# EAGLE schematic Machine Shop TinkerAccess (EAGLE 9.6.2)

## Sheet 1 of 3
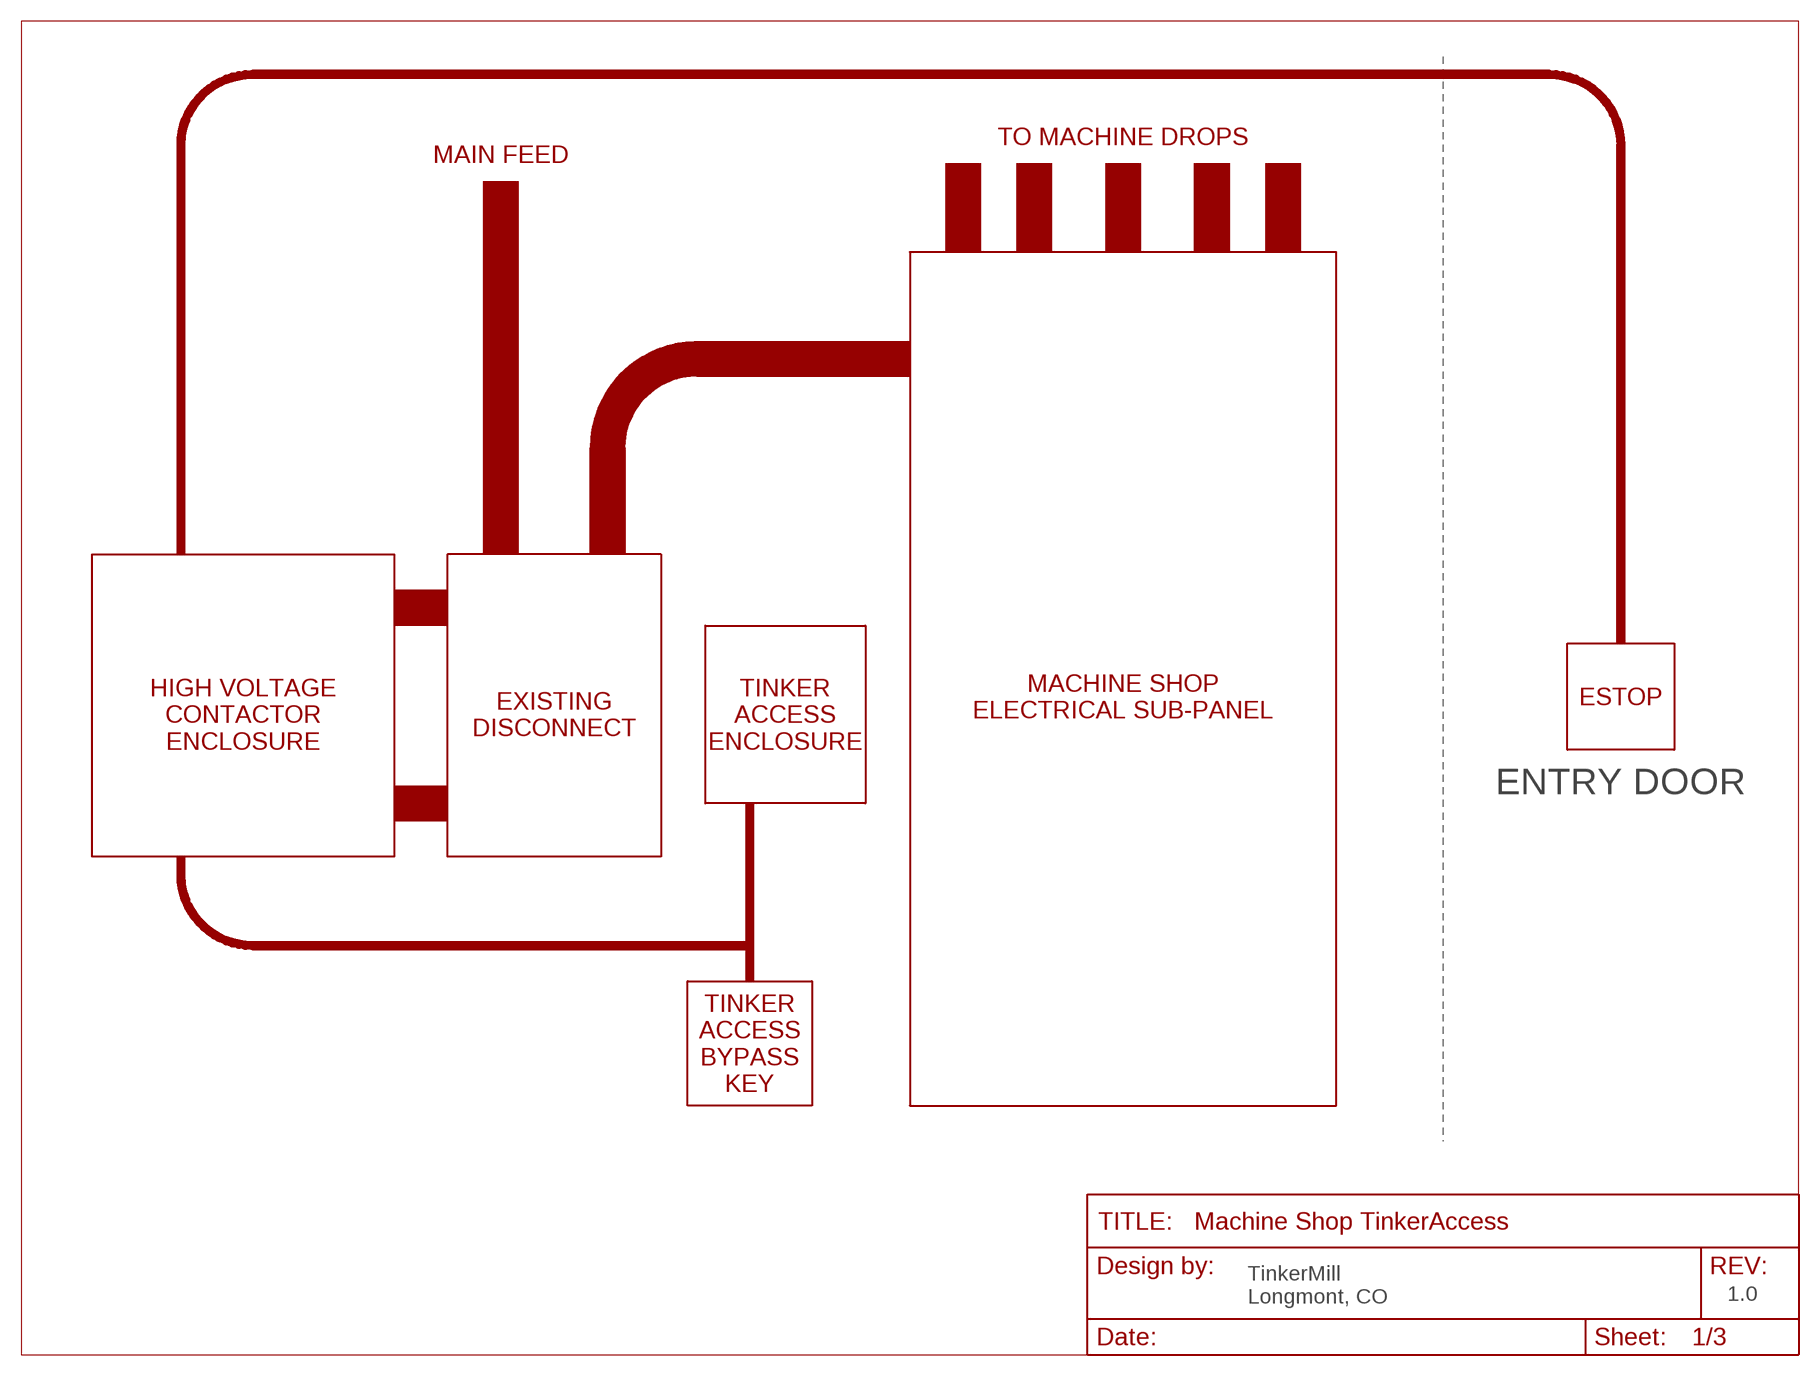
[diagram p0: schematic, sheet 1]

### Notes on the sheet
- TO MACHINE DROPS
- MAIN FEED
- MACHINE SHOP
  ELECTRICAL SUB-PANEL
- ESTOP
- HIGH VOLTAGE
  CONTACTOR
  ENCLOSURE
- EXISTING
  DISCONNECT
- TINKER
  ACCESS
  ENCLOSURE
- ENTRY DOOR
- TINKER
  ACCESS
  BYPASS
  KEY
- TinkerMill
  Longmont, CO
- 1.0

## Sheet 2 of 3
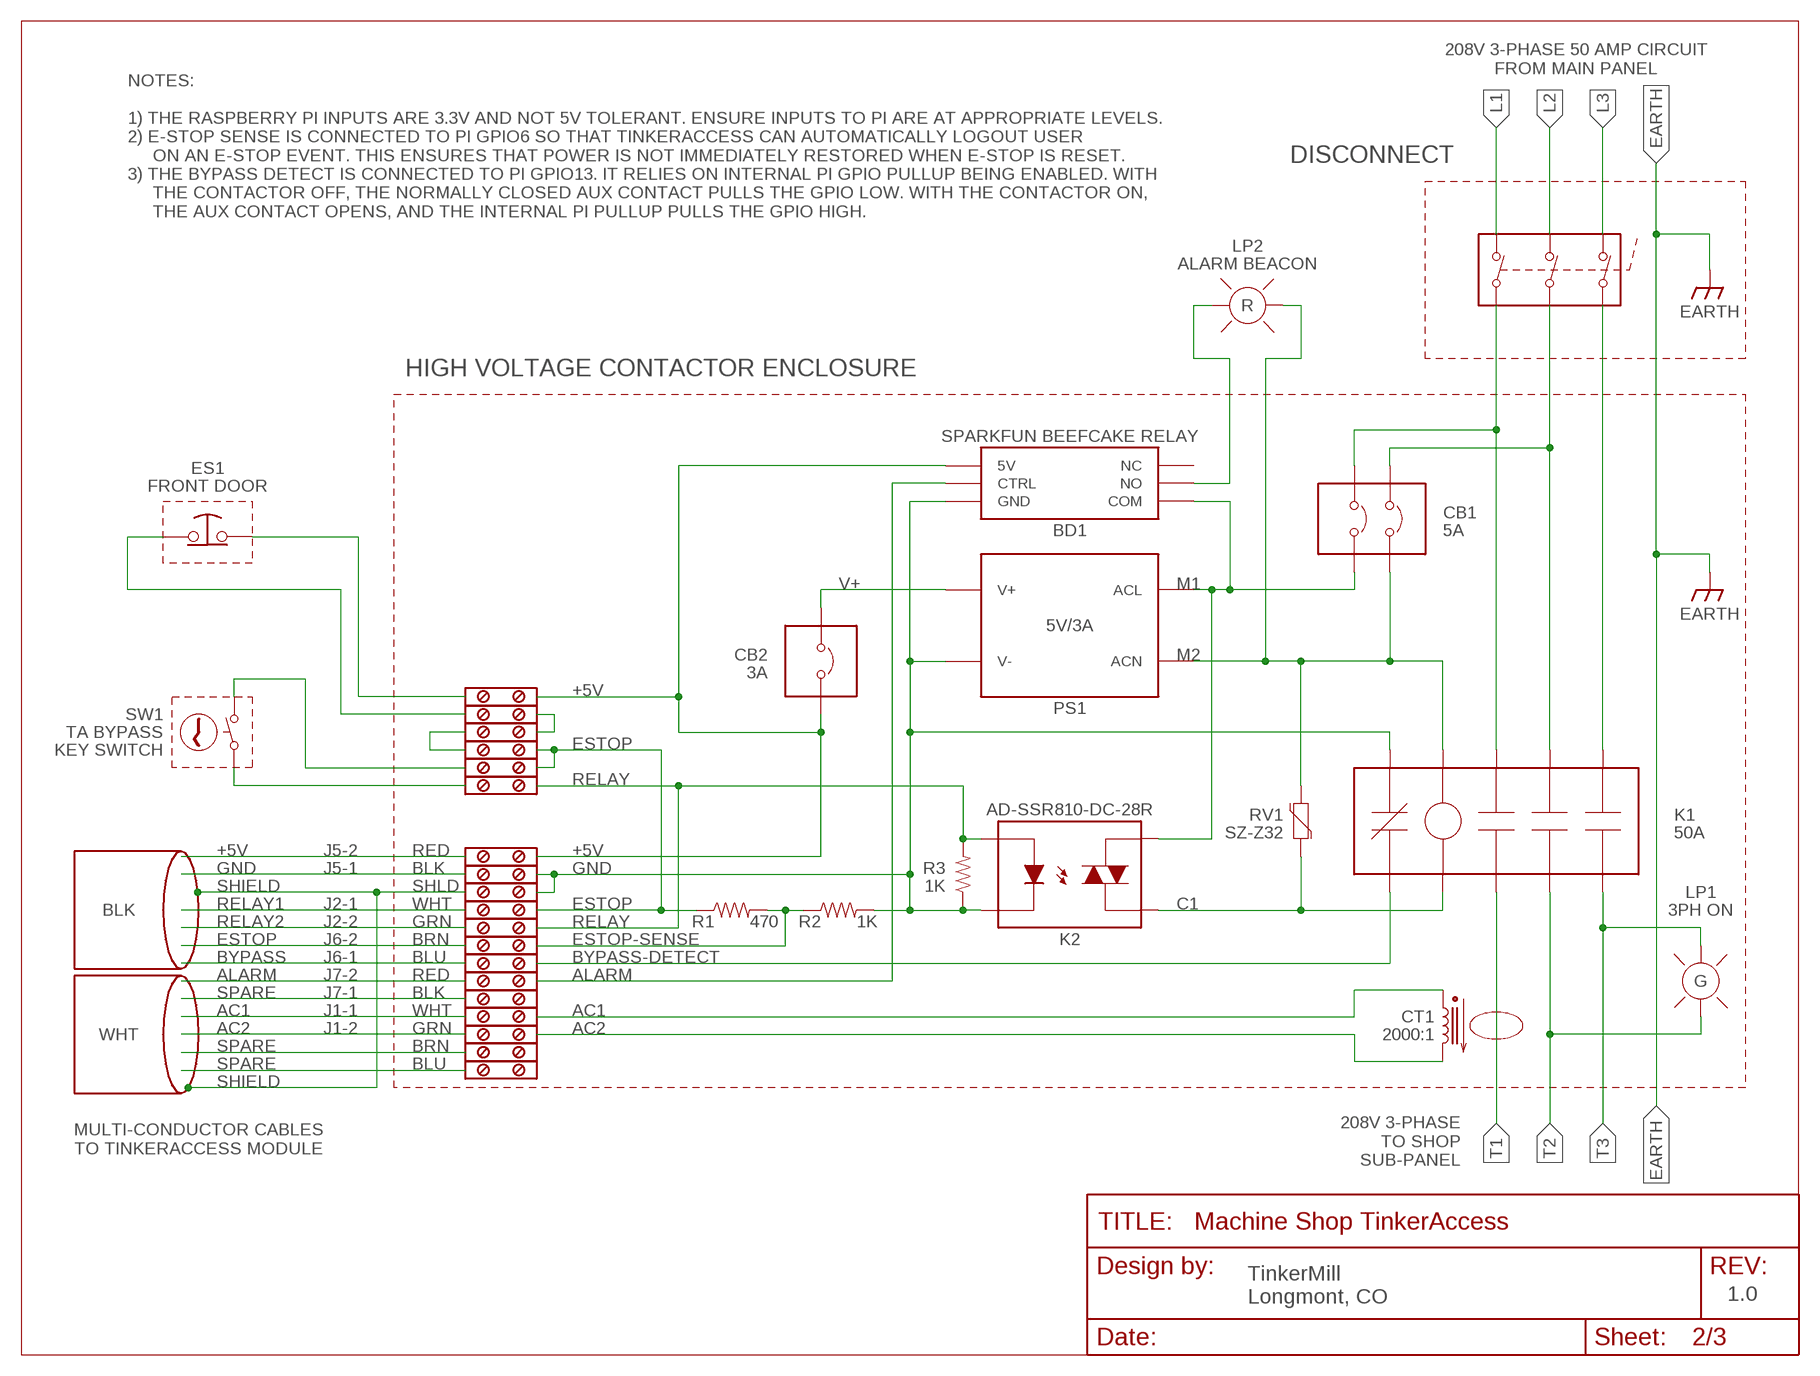
[diagram p1: schematic, sheet 2]

### Parts
BD1  SPARKFUN BEEFCAKE RELAY  SPARKFUN_BEEFCAKE  (no package)
CB1  5A  CIRCUIT_BREAKER_2POLE  (no package)
CB2  3A  CIRCUIT_BREAKER_1POLE  (no package)
CT1  2000:1  CURRENT_TRANSFORMER_TALEMA_AC1020  [TALEMA_AC1020]
ES1  FRONT DOOR  ESTOP_SWITCH  (no package)
K1  50A  CONTACTOR_3POLE_NC_AUX  (no package)
K2  AD-SSR810-DC-28R  SOLID_STATE_RELAY  (no package)
LP1  3PH ON  INDICATOR_LAMP  (no package)
LP2  ALARM BEACON  INDICATOR_LAMP  (no package)
PS1  5V/3A  POWER_SUPPLY  (no package)
R1  470  RESISTOR_PTH_1/4W  [AXIAL_0.4]
R2  1K  RESISTOR_PTH_1/4W  [AXIAL_0.4]
R3  1K  RESISTOR_PTH_1/4W  [AXIAL_0.4]
RV1  SZ-Z32  VARISTOR_EPCOS_SK14K320  [EPCOS_14MM_DISC_5.4MM_TH]
SW1  TA BYPASS  KEYED_SWITCH  (no package)
SW2  DISCONNECT_3POLE  (no package)
TB1  TERMINAL_BLOCK  (no package)
TB2  TERMINAL_BLOCK  (no package)
TB3  TERMINAL_BLOCK  (no package)
TB4  TERMINAL_BLOCK  (no package)
TB5  TERMINAL_BLOCK  (no package)
TB6  TERMINAL_BLOCK  (no package)
TB7  TERMINAL_BLOCK  (no package)
TB8  TERMINAL_BLOCK  (no package)
TB9  TERMINAL_BLOCK  (no package)
TB10  TERMINAL_BLOCK  (no package)
TB11  TERMINAL_BLOCK  (no package)
TB12  TERMINAL_BLOCK  (no package)
TB13  TERMINAL_BLOCK  (no package)
TB14  TERMINAL_BLOCK  (no package)
TB15  TERMINAL_BLOCK  (no package)
TB17  TERMINAL_BLOCK  (no package)
TB18  TERMINAL_BLOCK  (no package)
TB19  TERMINAL_BLOCK  (no package)
TB20  TERMINAL_BLOCK  (no package)

### Nets
+5V: BD1.5V CB2.T1 TB1.B TB13.B
AC1: CT1.1 TB10.B
AC2: CT1.2 TB4.B
ALARM: BD1.CTRL TB8.B
BLK1: TB2.A ; also sheet 3
BLK2: TB11.A ; also sheet 3
BLU1: TB9.A ; also sheet 3
BLU2: TB15.A ; also sheet 3
BRN1: TB7.A ; also sheet 3
BRN2: TB12.A ; also sheet 3
BYPASS-DETECT: K1.NC2 TB9.B
C1: K1.A2 K2.L2 RV1.1
ESTOP: R1.1 TB5.B TB18.B TB19.B
ESTOP-SENSE: R1.2 R2.1 TB7.B
GND: BD1.GND K1.NC1 K2.A2 PS1.V- R2.2 R3.1 TB2.B TB3.B
GRN1: TB6.A ; also sheet 3
GRN2: TB4.A ; also sheet 3
L1: SW2.L1
L2: SW2.L2
L3: SW2.L3
M1: BD1.COM CB1.T1 K2.L1 PS1.ACL
M2: CB1.T2 K1.A1 LP2.2 PS1.ACN RV1.2
N$1: TB17.A TB18.A
N$2: BD1.NO LP2.1
N$5: SW1.1 TB19.A
N$7: SW1.2 TB20.A
N$8: TB14.B TB17.B
N$15: ES1.1 TB14.A
N$16: ES1.2 TB13.A
RED1: TB1.A ; also sheet 3
RED2: TB8.A ; also sheet 3
RELAY: K2.A1 R3.2 TB6.B TB20.B
S1: CB1.L1 K1.L1 SW2.T1
S2: CB1.L2 K1.L2 SW2.T2
S3: K1.L3 SW2.T3
SHLD: TB3.A
T1: K1.T1
T2: K1.T2 LP1.1
T3: K1.T3 LP1.2
V+: CB2.L1 PS1.V+
WHT1: TB5.A ; also sheet 3
WHT2: TB10.A ; also sheet 3
Unconnected: BD1.NC TB11.B TB12.B TB15.B

### Notes on the sheet
- NOTES:
  
  1) THE RASPBERRY PI INPUTS ARE 3.3V AND NOT 5V TOLERANT. ENSURE INPUTS TO PI ARE AT APPROPRIATE LEVELS.
  2) E-STOP SENSE IS CONNECTED TO PI GPIO6 SO THAT TINKERACCESS CAN AUTOMATICALLY LOGOUT USER
       ON AN E-STOP EVENT. THIS ENSURES THAT POWER IS NOT IMMEDIATELY RESTORED WHEN E-STOP IS RESET.
  3) THE BYPASS DETECT IS CONNECTED TO PI GPIO13. IT RELIES ON INTERNAL PI GPIO PULLUP BEING ENABLED. WITH
       THE CONTACTOR OFF, THE NORMALLY CLOSED AUX CONTACT PULLS THE GPIO LOW. WITH THE CONTACTOR ON,
       THE AUX CONTACT OPENS, AND THE INTERNAL PI PULLUP PULLS THE GPIO HIGH.
- 208V 3-PHASE 50 AMP CIRCUIT
  FROM MAIN PANEL
- DISCONNECT
- R
- HIGH VOLTAGE CONTACTOR ENCLOSURE
- KEY SWITCH
- +5V | J5-2 | RED
- GND | J5-1 | BLK
- SHIELD | SHLD
- BLK | RELAY1 | J2-1 | WHT
- RELAY2 | J2-2 | GRN
- ESTOP | J6-2 | BRN
- BYPASS | J6-1 | BLU
- ALARM | J7-2 | RED | G
- SPARE | J7-1 | BLK
- AC1 | J1-1 | WHT
- WHT | AC2 | J1-2 | GRN
- SPARE | BRN
- SPARE | BLU
- SHIELD
- MULTI-CONDUCTOR CABLES
  TO TINKERACCESS MODULE
- 208V 3-PHASE
  TO SHOP
  SUB-PANEL
- TinkerMill
  Longmont, CO
- 1.0

## Sheet 3 of 3
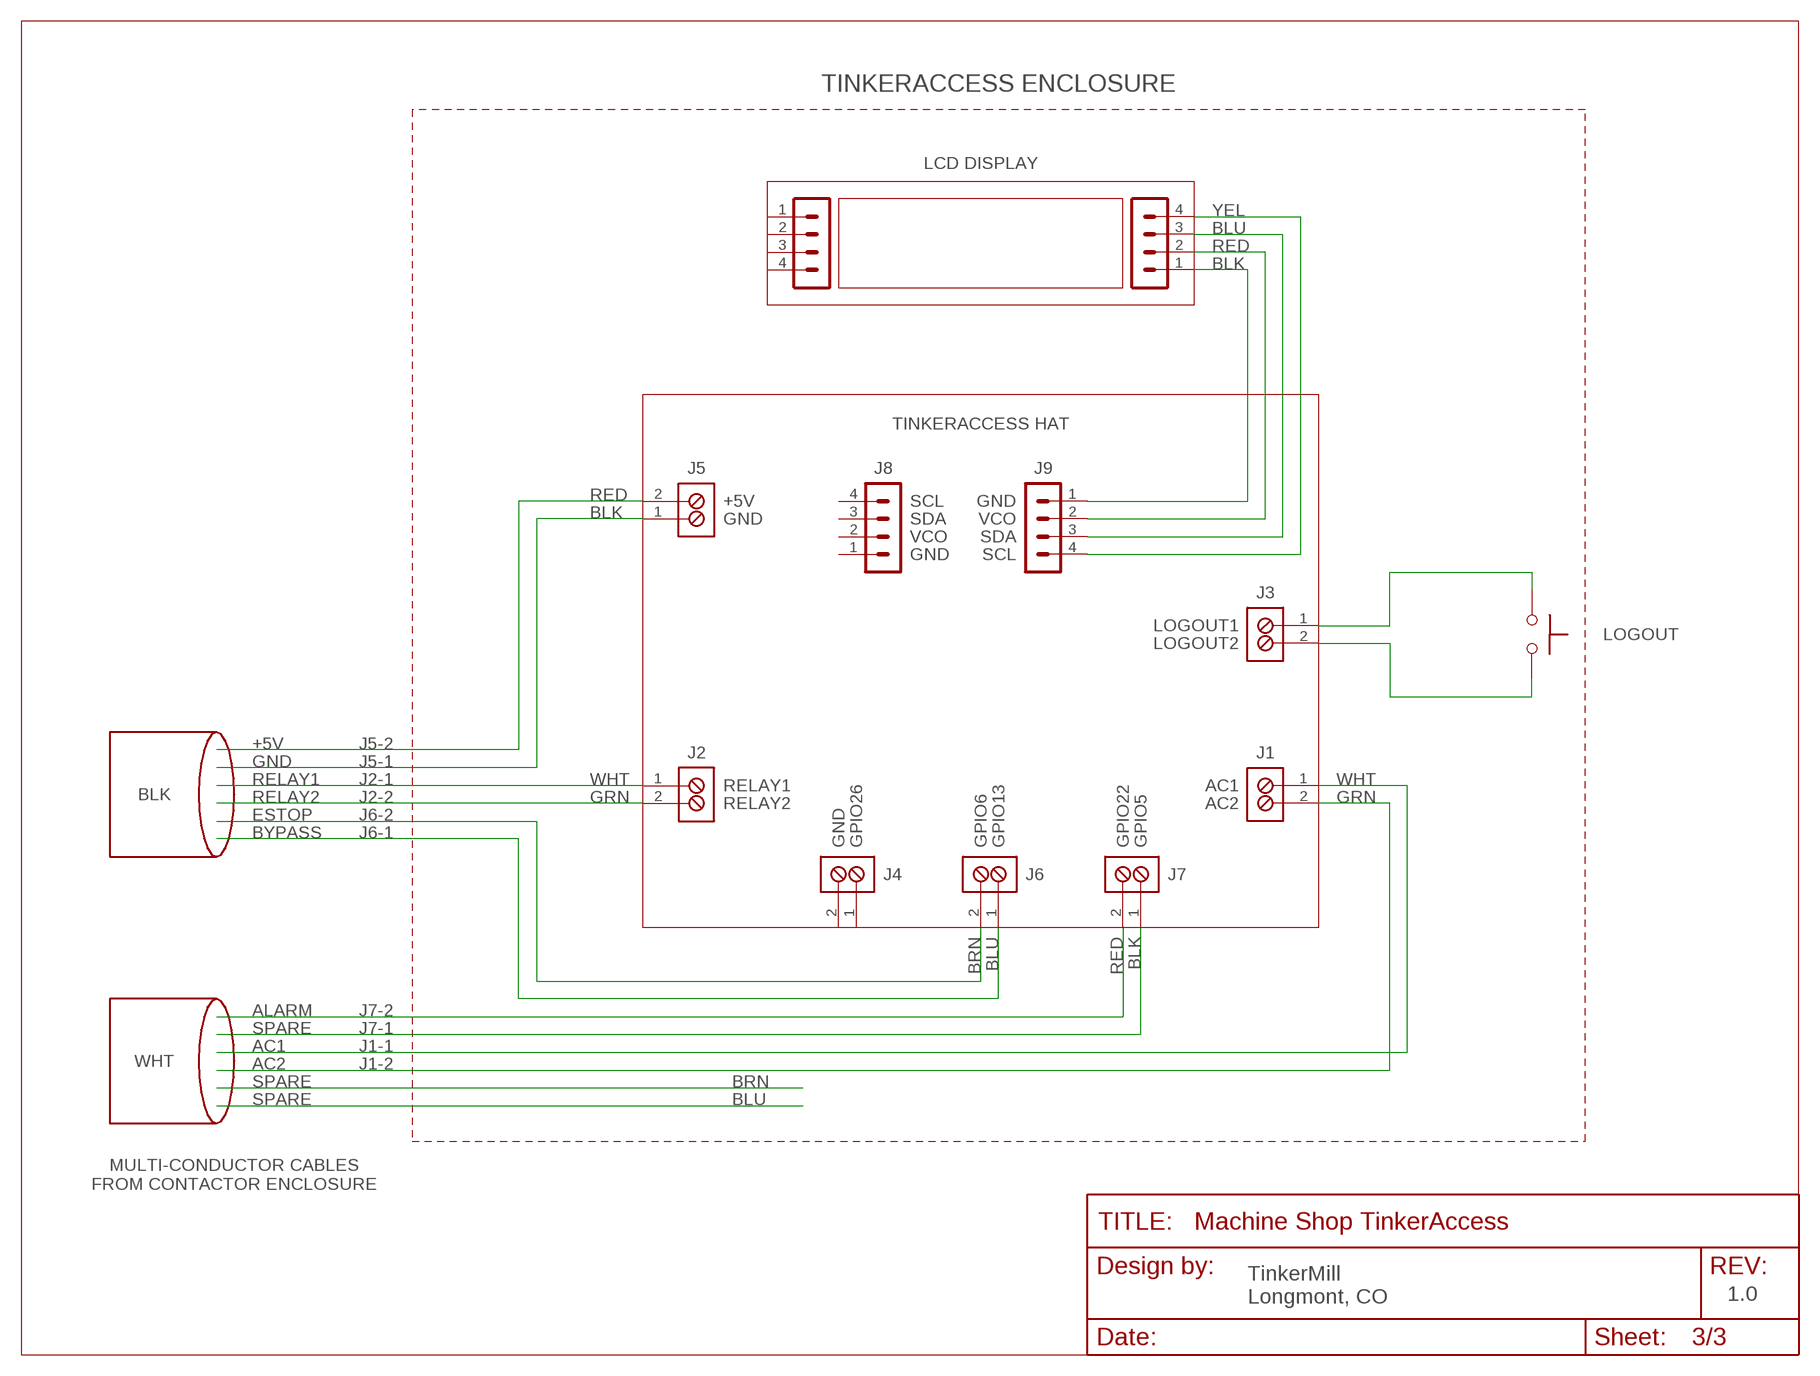
[diagram p2: schematic, sheet 3]

### Parts
J1  TB_2X1_TE_CONN_ED555_2DS  [TE_CONN_ED555_2DS]
J2  TB_2X1_TE_CONN_ED555_2DS  [TE_CONN_ED555_2DS]
J3  TB_2X1_TE_CONN_ED555_2DS  [TE_CONN_ED555_2DS]
J4  TB_2X1_TE_CONN_ED555_2DS  [TE_CONN_ED555_2DS]
J5  TB_2X1_TE_CONN_ED555_2DS  [TE_CONN_ED555_2DS]
J6  TB_2X1_TE_CONN_ED555_2DS  [TE_CONN_ED555_2DS]
J7  TB_2X1_TE_CONN_ED555_2DS  [TE_CONN_ED555_2DS]
J8  HDR_4X1_2.54MM_LOCKING_RA  [HDR_4X1_2.54MM_LOCKING_RA]
J9  HDR_4X1_2.54MM_LOCKING_RA  [HDR_4X1_2.54MM_LOCKING_RA]
J10  HDR_4X1_2.54MM_LOCKING_RA  [HDR_4X1_2.54MM_LOCKING_RA]
J11  HDR_4X1_2.54MM_LOCKING_RA  [HDR_4X1_2.54MM_LOCKING_RA]
SW3  LOGOUT  PUSHBUTTON_MOMENTARY_NO_OMRON_B3F_6MM  [OMRON_B3F_6MM]

### Nets
BLK1: J5.1 ; also sheet 2
BLK2: J7.1 ; also sheet 2
BLU1: J6.1 ; also sheet 2
BRN1: J6.2 ; also sheet 2
GRN1: J2.2 ; also sheet 2
GRN2: J1.2 ; also sheet 2
N$3: J3.1 SW3.1 SW3.2
N$4: J3.2 SW3.3 SW3.4
N$17: J9.1 J11.1
N$18: J9.2 J11.2
N$19: J9.3 J11.3
N$20: J9.4 J11.4
RED1: J5.2 ; also sheet 2
RED2: J7.2 ; also sheet 2
WHT1: J2.1 ; also sheet 2
WHT2: J1.1 ; also sheet 2
Unconnected: J4.1 J4.2 J8.1 J8.2 J8.3 J8.4 J10.1 J10.2 J10.3 J10.4

### Notes on the sheet
- TINKERACCESS ENCLOSURE
- LCD DISPLAY
- YEL
- BLU
- RED
- BLK
- TINKERACCESS HAT
- RED | +5V | SCL | GND
- BLK | GND | SDA | VCO
- VCO | SDA
- GND | SCL
- LOGOUT1
- LOGOUT2
- +5V | J5-2
- GND | J5-1
- RELAY1 | J2-1 | WHT | RELAY1 | AC1 | WHT
- BLK
- RELAY2 | J2-2 | GRN | RELAY2 | AC2 | GRN
- ESTOP | J6-2
- BYPASS | J6-1
- GND | GPIO26 | GPIO6 | GPIO13 | GPIO22 | GPIO5
- BRN | BLU | RED | BLK
- ALARM | J7-2
- SPARE | J7-1
- AC1 | J1-1
- WHT
- AC2 | J1-2
- SPARE | BRN
- SPARE | BLU
- MULTI-CONDUCTOR CABLES
  FROM CONTACTOR ENCLOSURE
- TinkerMill
  Longmont, CO
- 1.0

## Library data of the parts
BD1 = TMF_Schematic_Only:SPARKFUN_BEEFCAKE
CB1 = TMF_Schematic_Only:CIRCUIT_BREAKER_2POLE
CB2 = TMF_Schematic_Only:CIRCUIT_BREAKER_1POLE
CT1 = TMF_Inductors:CURRENT_TRANSFORMER
ES1 = TMF_Schematic_Only:ESTOP_SWITCH
J1-J7 = TMF_Connectors:TB_2X1
J8-J11 = TMF_Connectors:HDR_4X1
K1 = TMF_Schematic_Only:CONTACTOR_3POLE_NC_AUX
K2 = TMF_Schematic_Only:SOLID_STATE_RELAY
LP1 LP2 = TMF_Schematic_Only:INDICATOR_LAMP
PS1 = TMF_Schematic_Only:POWER_SUPPLY
R1-R3 = TMF_Resistors:RESISTOR
RV1 = TMF_Passives:VARISTOR
SW1 = TMF_Schematic_Only:KEYED_SWITCH
SW2 = TMF_Schematic_Only:DISCONNECT_3POLE
SW3 = TMF_Switches:PUSHBUTTON_MOMENTARY_NO
TB1-TB15 TB17-TB20 = TMF_Schematic_Only:TERMINAL_BLOCK